# EAGLE design BOOST-IR (EAGLE 6.5.0)
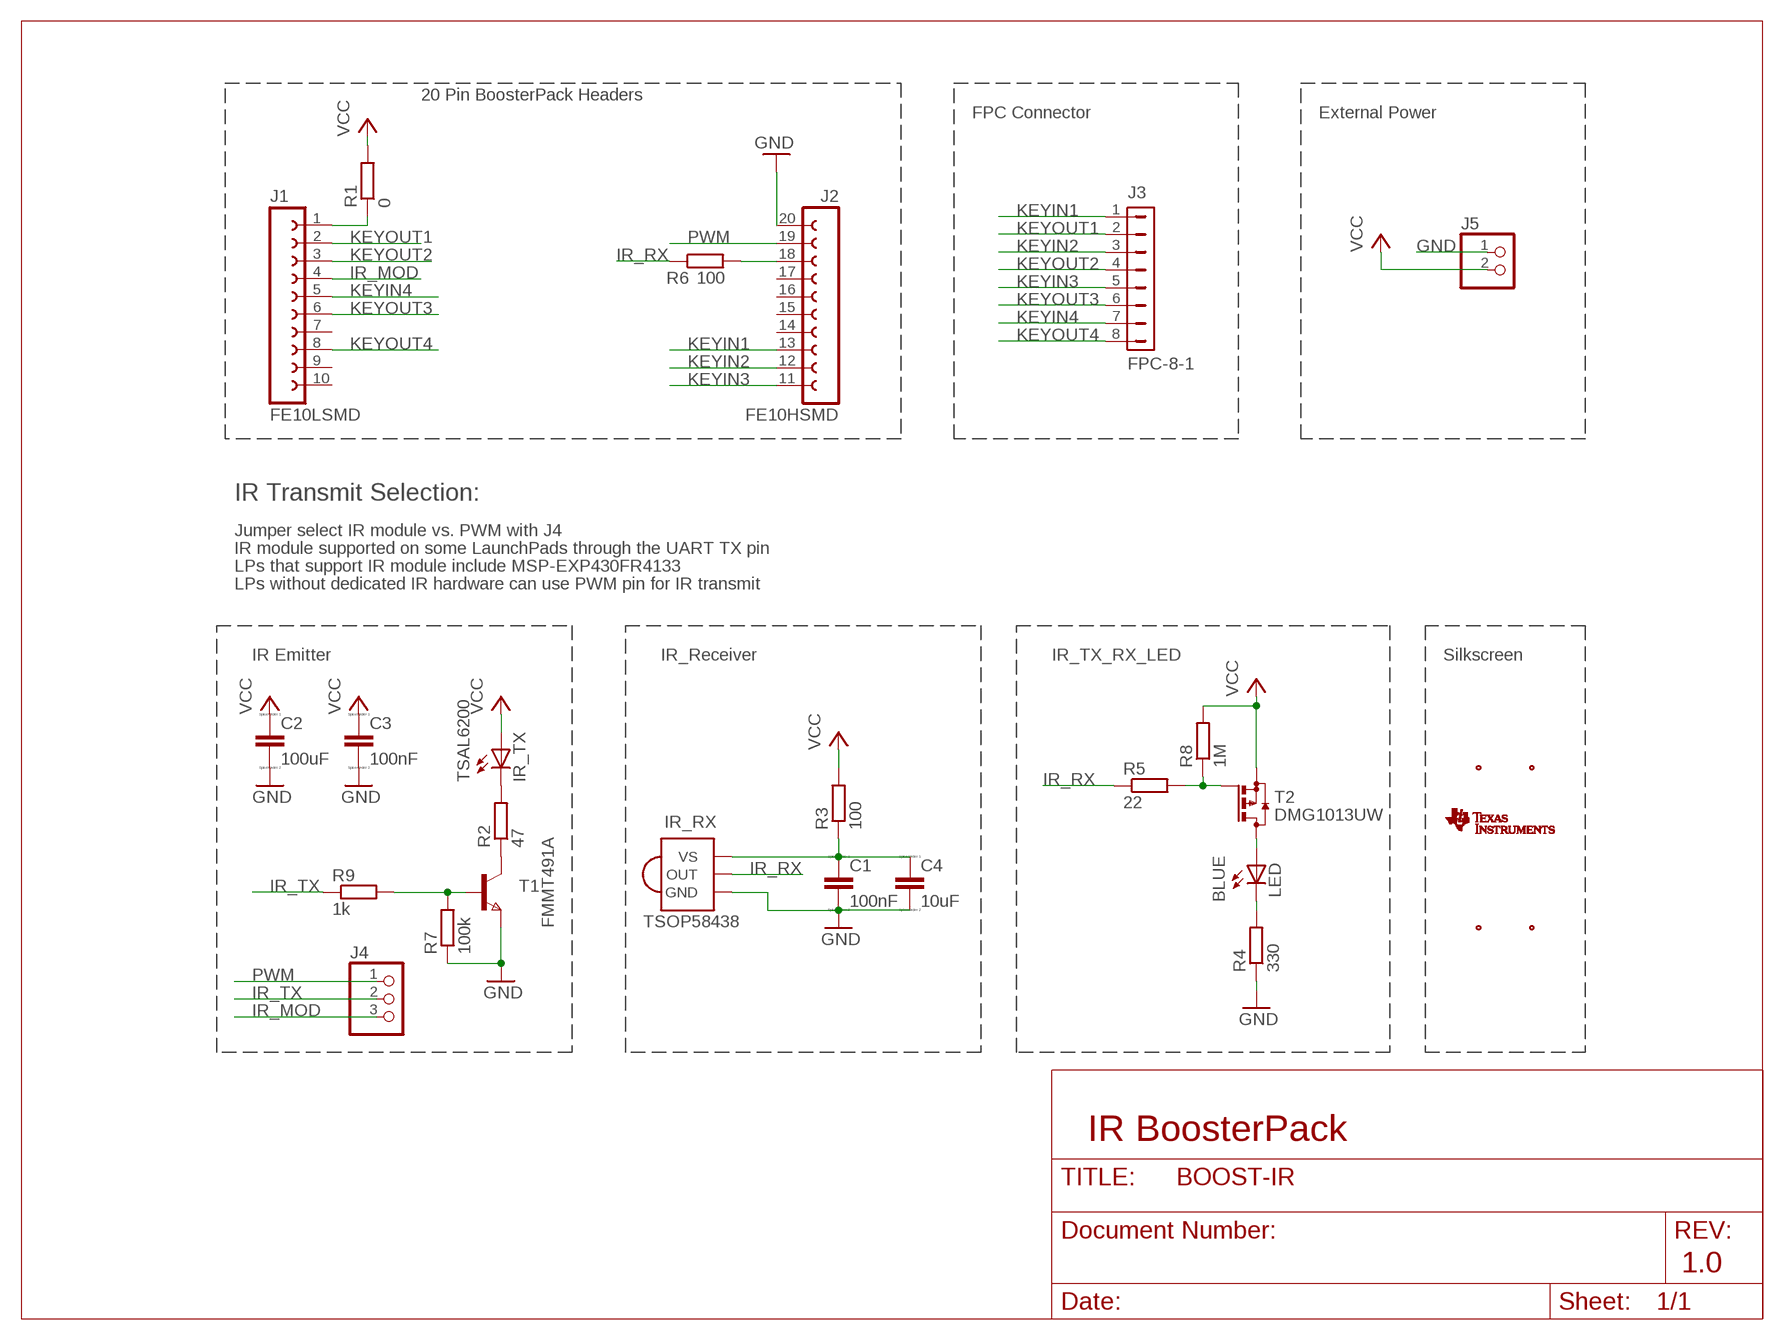
[diagram p0: schematic, sheet 1]

## Parts
C1  100nF  CC0603  [C0603]
C2  100uF  CC1206  [C1206]
C3  100nF  CC0603  [C0603]
C4  10uF  C  [C0805]
IR_RX  TSOP58438  [TSOP58438]
IR_TX  TSAL6200  IR_LED  [IR_LED_PAC]
J1  FE10LSMD  [FE10SMD]
J2  FE10HSMD  [FE10HSMD]
J3  FPC-8-1  FPC_BP  [FPC_IR]
J4  PINHD1X3  [1X03]
J5  HEADER1X2  [HEADER1X2]
LED  BLUE  LEDCHIPLED_0603  [CHIPLED_0603]
R1  0  R-EU_R1206  [R1206]
R2  47  R-EU_R1206  [R1206]
R3  100  R-EU_R0603  [R0603]
R4  330  R-EU_R0603  [R0603]
R5  22  R-EU_R0603  [R0603]
R6  100  R-EU_R0603  [R0603]
R7  100k  R-EU_R0603  [R0603]
R8  1M  R-EU_R0603  [R0603]
R9  1k  R-EU_R0603  [R0603]
T1  FMMT491A  NPNSOT23  [SOT-23]
T2  DMG1013UW  [SOT323]
U$1  BOOST-IR_EXTPOWER  [BOOST-IR_EXTPOWER]
U$3  TI_LOGO_LETTERS  [TI_LOGO_WORDS]
U$4  BOOST-IR_LABEL  [BOOST-IR_LABEL]
U$5  BOOST-IR_REV0.1LOGO  [BOOST-IR_LOGO]
U$6  BOOST-IR_REV0.1LOGOSMALL  [BOOST-IR_LOGOSMALL]

## Nets
GND: C1.2 C2.2 C3.2 C4.2 IR_RX.GND J2.20 J5.1 R4.1 R7.1 T1.2(E)
IR_MOD: J1.4 J4.3
IR_RX: IR_RX.OUT R5.1 R6.1
IR_TX: J4.2 R9.1
KEYIN1: J2.13 J3.1
KEYIN2: J2.12 J3.3
KEYIN3: J2.11 J3.5
KEYIN4: J1.5 J3.7
KEYOUT1: J1.2 J3.2
KEYOUT2: J1.3 J3.4
KEYOUT3: J1.6 J3.6
KEYOUT4: J1.8 J3.8
N$1: R2.1 T1.1(C)
N$2: IR_TX.K(C) R2.2
N$4: R7.2 R9.2 T1.3(B)
N$5: C1.1 C4.1 IR_RX.VS R3.1
N$9: R5.2 R8.1 T2.1(G)
N$10: LED.A T2.3(D)
N$11: LED.C R4.2
N$12: J2.18 R6.2
N$15: J1.1 R1.1
PWM: J2.19 J4.1
VCC: C2.1 C3.1 IR_TX.A J5.2 R1.2 R3.2 R8.2 T2.2(S)
Unconnected: J1.7 J1.9 J1.10 J2.14 J2.15 J2.16 J2.17

## Notes on the sheet
- 20 Pin BoosterPack Headers
- FPC Connector | External Power
- IR Transmit Selection:
- Jumper select IR module vs. PWM with J4
- IR module supported on some LaunchPads through the UART TX pin
- LPs that support IR module include MSP-EXP430FR4133
- LPs without dedicated IR hardware can use PWM pin for IR transmit
- IR Emitter | IR_Receiver | IR_TX_RX_LED | Silkscreen
- IR BoosterPack
- 1.0

## Library data of the parts
C1-C4 = eagle-ltspice:C: CAPACITOR, European symbol; SPICEMODEL: NONE; SPICEPREFIX: C
IR_RX = TSOP58438:TSOP58438: IR Receiver Modules for Remote Control Systems; IR: TSOP58438
IR_TX = IrBoosterPack:IR_LED
J1 = LibraryLaunchPad:FE10LSMD
J2 = LibraryLaunchPad:FE10HSMD
J3 = FPC_IR:FPC_BP
J4 = F5529LP_pinhead:PINHD1X3
J5 = F5529LP_pinhead:HEADER1X2
LED = led:LED: LED OSRAM: - CHIPLED LG R971, LG N971, LY N971, LG Q971, LY Q971, LO R971, LY R971 LH N974, LH R974 LS Q976, LO Q976, LY Q976 LO Q996 - Hyper CHIPLED LW Q18S LB Q993, LB Q99A, LB R99A - SideLED LS A670, LO A670, LY A670, LG A670, LP A670 LB A673, LV A673, LT A673, LW A673 LH A674 LY A675 LS A676, LA A676, LO A676, LY A676, LW A676 LS A679, LY A679, LG A679 - Hyper Micro SIDELED® LS Y876, LA Y876, LO Y876, LY Y876 LT Y87S - SmartLED LW L88C, LW L88S LB L89C, LB L89S, LG L890 LS L89K, LO L89K, LY L89K LS L896, LA L896, LO L896, LY L896 - TOPLED LS T670, LO T670, LY T670, LG T670, LP T670 LSG T670, LSP T670, LSY T670, LOP T670, LYG T670 LG T671, LOG T671, LSG T671 LB T673, LV T673, LT T673, LW T673 LH T674 LS T676, LA T676, LO T676, LY T676, LB T676, LH T676, LSB T676, LW T676 LB T67C, LV T67C, LT T67C, LS T67K, LO T67K, LY T67K, LW E67C LS E67B, LA E67B, LO E67B, LY E67B, LB E67C, LV E67C, LT E67C LW T67C LS T679, LY T679, LG T679 LS T770, LO T770, LY T770, LG T770, LP T770 LB T773, LV T773, LT T773, LW T773 LH T774 LS E675, LA E675, LY E675, LS T675 LS T776, LA T776, LO T776, LY T776, LB T776 LHGB T686 LT T68C, LB T68C - Hyper Mini TOPLED® LB M676 - Mini TOPLED Santana® LG M470 LS M47K, LO M47K, LY M47K Source: http://www.osram.convergy.de LUXEON: - LUMILED® LXK2-PW12-R00, LXK2-PW12-S00, LXK2-PW14-U00, LXK2-PW14-V00 LXK2-PM12-R00, LXK2-PM12-S00, LXK2-PM14-U00 LXK2-PE12-Q00, LXK2-PE12-R00, LXK2-PE12-S00, LXK2-PE14-T00, LXK2-PE14-U00 LXK2-PB12-K00, LXK2-PB12-L00, LXK2-PB12-M00, LXK2-PB14-N00, LXK2-PB14-P00, LXK2-PB14-Q00 LXK2-PR12-L00, LXK2-PR12-M00, LXK2-PR14-Q00, LXK2-PR14-R00 LXK2-PD12-Q00, LXK2-PD12-R00, LXK2-PD12-S00 LXK2-PH12-R00, LXK2-PH12-S00 LXK2-PL12-P00, LXK2-PL12-Q00, LXK2-PL12-R00 Source: www.luxeon.com KINGBRIGHT: KA-3528ASYC Source: www.kingbright.com
R1-R9 = rcl:R-EU_: RESISTOR, European symbol
T1 = zetex:NPNSOT23: NPN TRANSISTOR; MPN: DSS20201L-7; OC_FARNELL: 1710688; OC_NEWARK: 25R4555
T2 = MSP430G6_LP:DMG1013UW
U$1 = LaunchPad:BOOST-IR_EXTPOWER
U$3 = LaunchPad:TI_LOGO_LETTERS
U$4 = LaunchPad:BOOST-IR_LABEL
U$5 = LaunchPad:BOOST-IR_REV0.1LOGO
U$6 = LaunchPad:BOOST-IR_REV0.1LOGOSMALL

## Board
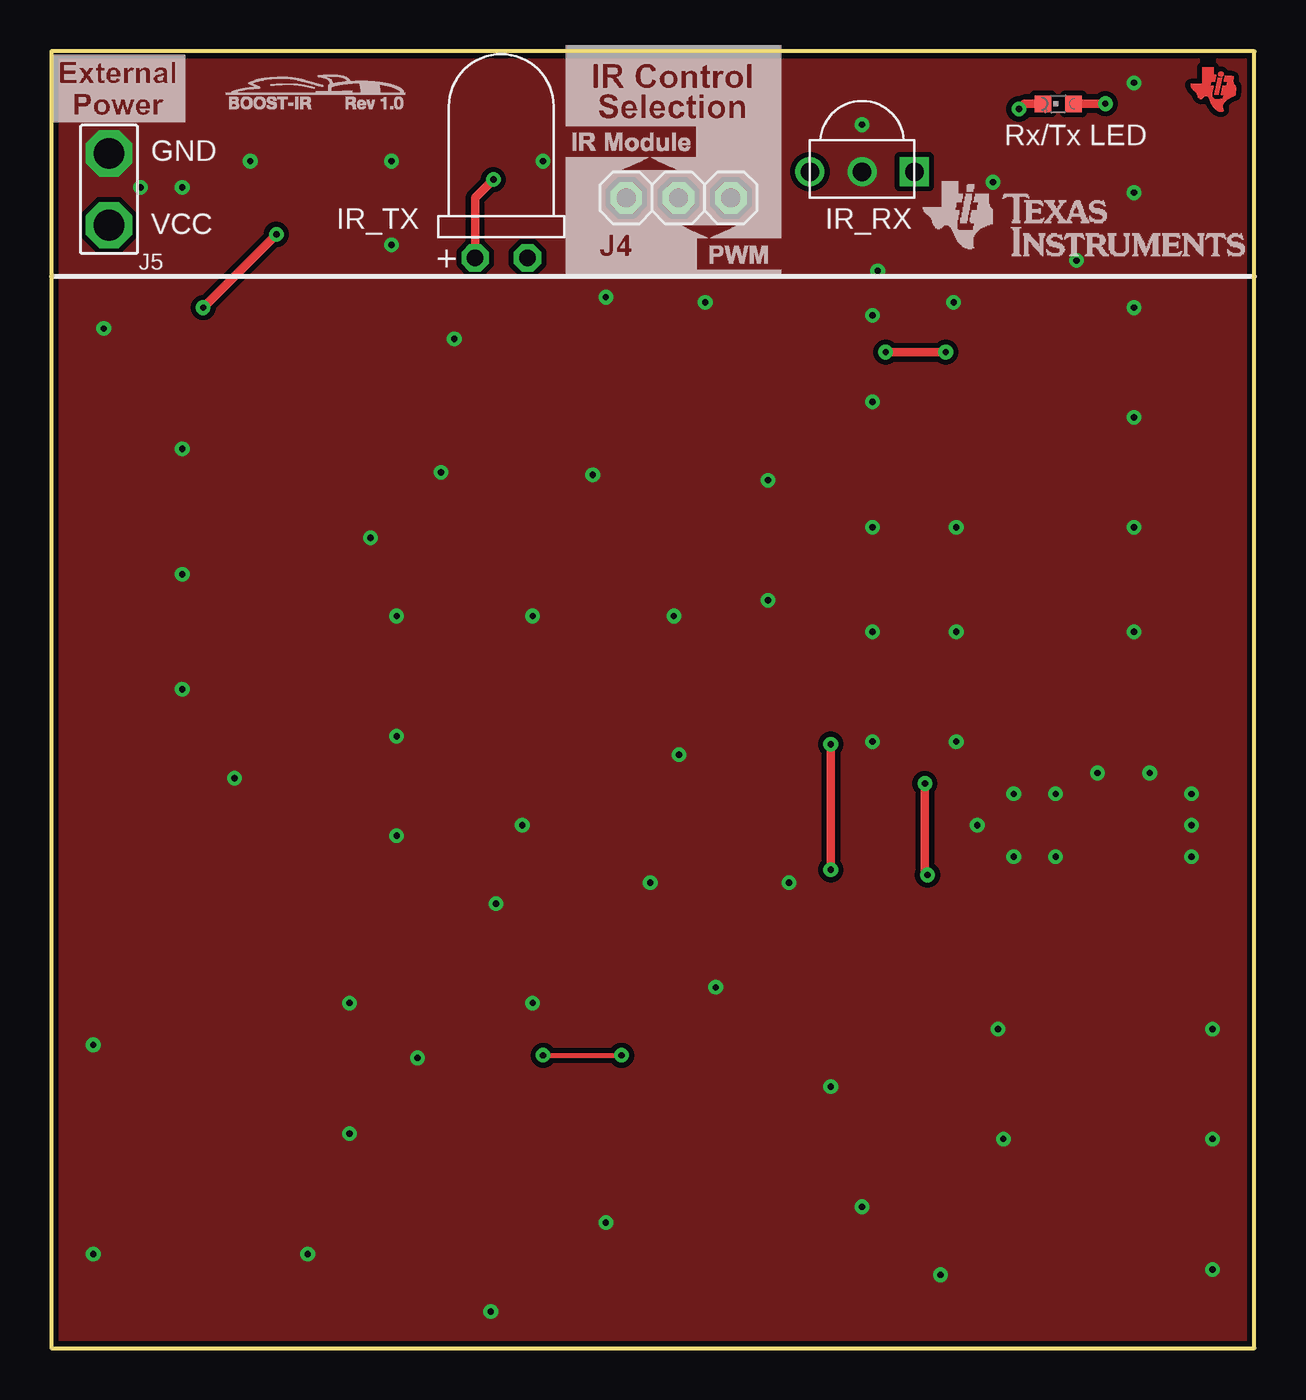
[diagram p1: board, top side]
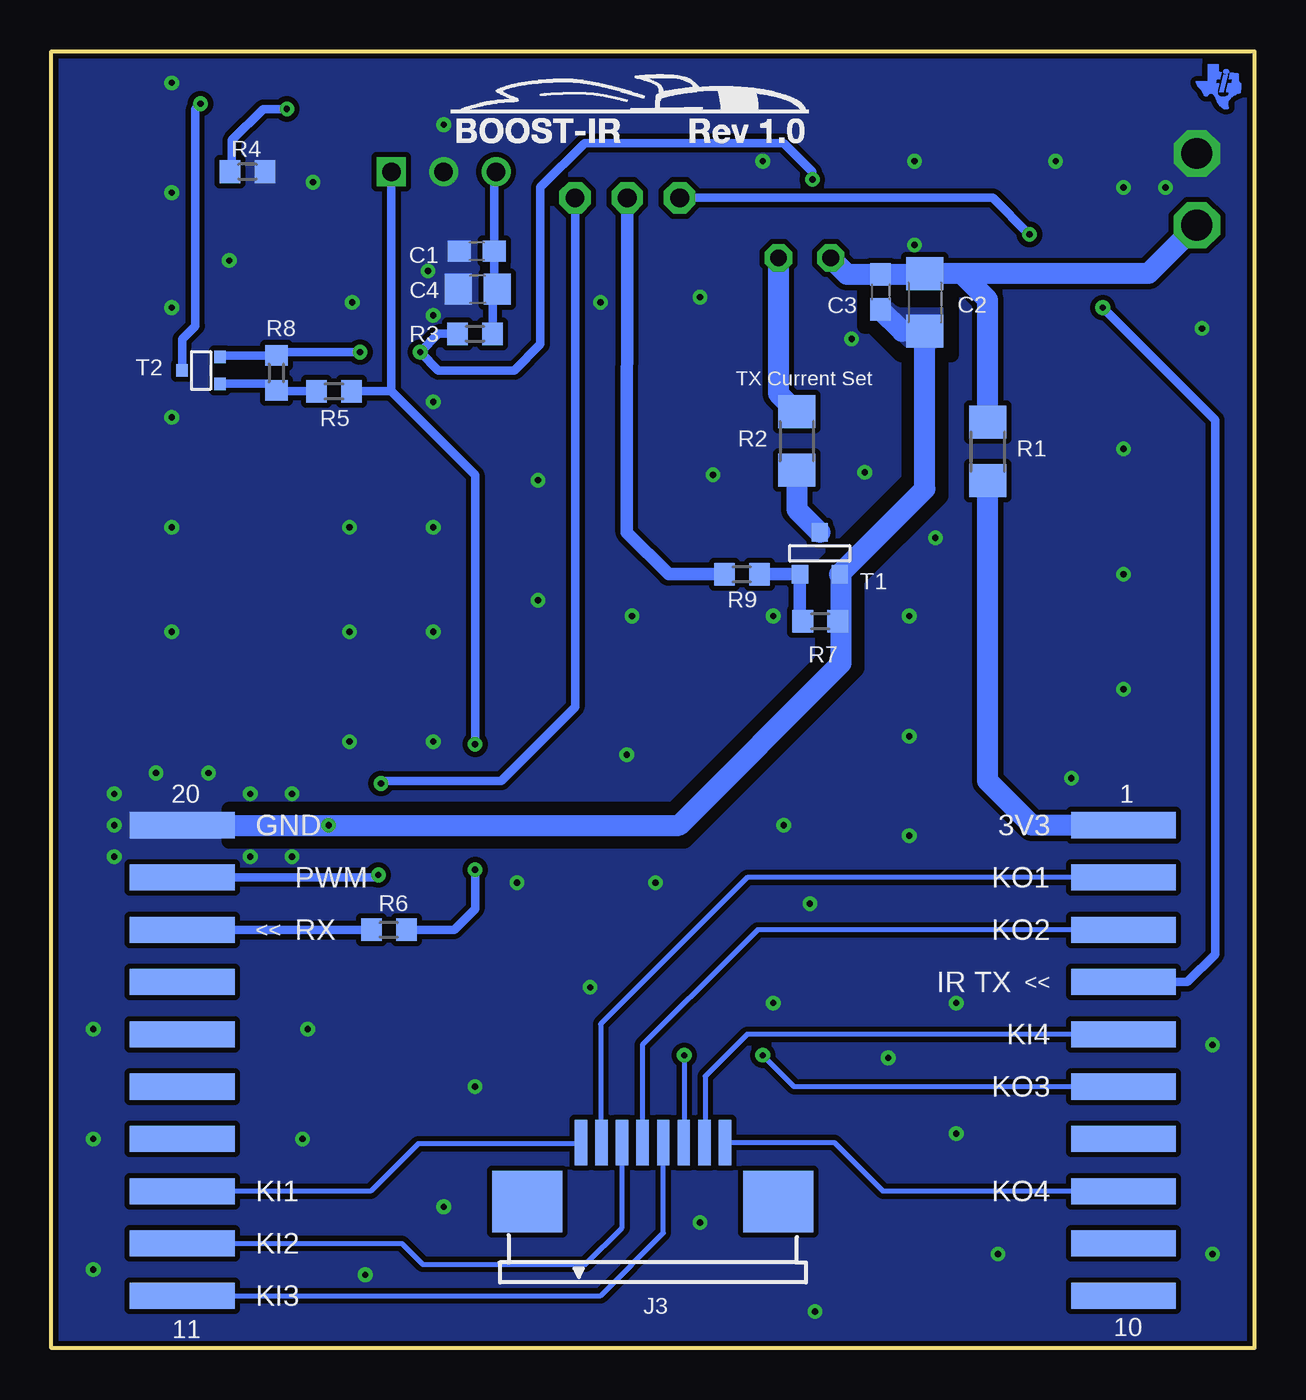
[diagram p2: board, bottom side, seen from below]

Size 58.42 x 62.99 mm. Coordinates in mm from the lower left corner, seen from the top.
Outline: 0,0 58.42,0 58.42,62.99 0,62.99 0,0
Copper layers (1+2*15+16): Top 0.0178mm / dielectric 12mil / Route2 0.0356mm / dielectric 27mil / Route15 0.0356mm / dielectric 12mil / Bottom 0.0178mm
Design rules "MSP430 PCBExpress 4-layer-dietmar": minimum track width 6mil, minimum drill 12mil, track to track 6mil, track to pad 6mil, pad to pad 6mil, via to via 8mil, smd to smd 6mil, copper to edge 8mil, drill to drill 8mil, minimum pad ring 10mil, minimum via ring 8mil, stop-mask expansion 8mil, vias tented up to drill 15mil, thermal gap 8mil
bRestrict: 20 lines

### Footprints (pad centres in the part's own frame; a part is rotated, then mirrored left to right if it is on the bottom)
C0603 = smd 1.1 x 1: 1 -0.85,0; 2 0.85,0
C1206 = smd 1.6 x 1.8: 1 -1.4,0; 2 1.4,0
C0805 = smd 1.3 x 1.5: 1 -0.95,0; 2 0.95,0
TSOP58438 = drill 0.9: GND 0,0; VS 2.54,0 | drill 0.9 square: OUT -2.54,0
IR_LED_PAC = drill 0.813 octagon: A -1.27,0; K 1.27,0
FE10SMD = smd 1.27 x 5.08: 1 0,0; 2 2.54,0; 3 5.08,0; 4 7.62,0; 5 10.16,0; 6 12.7,0; 7 15.24,0; 8 17.78,0; 9 20.32,0; 10 22.86,0
FE10HSMD = smd 1.27 x 5.08: 11 0,0; 12 -2.54,0; 13 -5.08,0; 14 -7.62,0; 15 -10.16,0; 16 -12.7,0; 17 -15.24,0; 18 -17.78,0; 19 -20.32,0; 20 -22.86,0
FPC_IR = smd 0.6 x 2.2: 1 -3.5,4.4; 2 -2.5,4.4; 3 -1.5,4.4; 4 -0.5,4.4; 5 0.5,4.4; 6 1.5,4.4; 7 2.5,4.4; 8 3.5,4.4 | smd 3.4 x 3: P$1 6.096,1.524; P$2 -6.096,1.524
1X03 = drill 0.914 pad 1.524 octagon: 1 -2.54,0; 2 0,0; 3 2.54,0
HEADER1X2 = drill 1.5 pad 2.2 octagon: 1 0,0; 2 3.49,0
CHIPLED_0603 = smd 0.8 x 0.8: A 0,-0.75; C 0,0.75
R1206 = smd 1.6 x 1.803: 1 -1.422,0; 2 1.422,0
R0603 = smd 1 x 1.1: 1 -0.85,0; 2 0.85,0
SOT-23 = smd 0.787 x 0.889: 1 0.025,-1.016; 2 -0.94,1.016; 3 0.991,1.016
SOT323 = smd 0.6 x 0.55: 1 -0.65,-0.825; 2 0.65,-0.825; 3 0,1.025

### Placement (x,y rotation side)
C1  37.77,53.29 180 bottom
C2  16,50.8 270 bottom
C3  18.16,51.31 270 bottom
C4  37.72,51.44 180 bottom
IR_RX  39.37,57.15 180 top
IR_TX  21.84,52.96 0 top
J1  6.35,25.4 270 bottom
J2  52.07,2.54 270 bottom
J3  29.21,5.59 0 bottom
J4  30.45,55.88 180 top
J5  2.79,58.04 270 top
LED  48.9,60.45 90 top
R1  12.95,43.56 90 bottom
R2  22.23,44.07 90 bottom
R3  37.85,49.28 180 bottom
R4  48.9,57.15 180 bottom
R5  44.7,46.48 180 bottom
R6  42.04,20.32 180 bottom
R7  21.08,35.31 180 bottom
R8  47.5,47.37 90 bottom
R9  24.89,37.59 0 bottom
T1  21.08,38.61 180 bottom
T2  51.05,47.5 90 bottom
U$1  0,59.56 0 top
U$2  [TILOGO_SMALL]  56.57,61.42 0 top
U$3  41.99,52.3 0 top
U$4  24.79,52.02 0 top
U$5  21.08,58.55 0 top
U$6  8.38,60.2 0 top
U$7  [TILOGO_SMALL]  1.6,61.54 0 bottom

### Tracks (layer width: path | path; a pad name or v marks a point on that pad's centre or on a via)
GND  (via drill 0.3)
  Bottom 1.016: J2.20 27.94,25.4 20.07,33.27 20.07,37.52 T1.2 16,41.73 C2.2 17.1,49.4 C3.2
  other vias: 6.35,37.59 8.89,27.69 40.13,52.32 39.88,50.16 39.88,45.97 39.88,39.88 39.88,34.8 43.94,39.88 43.94,34.8 43.94,29.46 39.88,29.46 44.96,25.4 46.74,26.92 46.74,23.88 55.37,23.88 55.37,25.4 55.37,26.92 53.34,27.94 50.8,27.94 48.77,26.92 52.58,34.8 52.58,39.88 52.58,45.21 52.58,50.55 52.58,56.13 4.32,56.39 6.35,56.39 9.65,57.66 16.51,57.66 23.88,57.66 39.37,59.44 45.72,56.64 49.78,52.83 43.81,50.8 2.54,49.53 6.35,32 6.35,43.69 2.03,14.73 2.03,4.57 12.45,4.57 26.92,6.1 21.34,1.78 43.18,3.56 39.37,6.86 46.23,10.16 45.97,15.49 37.85,12.7 29.08,22.61 35.81,22.61 32.26,17.53 16.76,24.89 16.76,29.72 16.76,35.56 15.49,39.37 23.37,35.56 30.23,35.56 30.48,28.83 31.75,50.8 26.92,51.05 19.56,49.02 16.51,53.59 52.58,61.47 34.8,42.16 34.8,36.32 26.29,42.42 14.48,16.76 23.37,16.76 21.59,21.59 14.48,10.41 48.77,23.88 56.39,15.49 56.39,10.16 56.39,3.81 22.86,25.4 17.78,14.1 18.92,42.55
  pour Bottom (isolate 0.254, no thermals): 0,62.99 0,0 58.42,0 58.42,62.99
  pour Top (isolate 0.254, no thermals): 0,62.99 0,0 58.42,0 58.42,62.99
IR_MOD  (via drill 0.3)
  Top 0.406: v10.92,54.1 v7.37,50.55
  Bottom 0.406: J1.4 3.25,17.78 1.91,19.13 1.91,45.09 v7.37,50.55 | J4.3 12.7,55.88 v10.92,54.1
IR_RX  (via drill 0.3)
  Top 0.406: v37.85,29.34 v37.85,23.24
  Bottom 0.406: v37.85,29.34 37.85,42.42 41.91,46.48 | R5.1 41.91,46.48 | v37.85,23.24 37.85,21.34 38.86,20.32 R6.1 | IR_RX.OUT 41.91,46.48
IR_TX
  Bottom 0.61: R9.1 28.45,37.59 30.48,39.62 J4.2
KEYIN1
  Bottom 0.254: J2.13 42.93,7.62 40.61,9.93 32.77,9.93 J3.1
KEYIN2
  Bottom 0.254: J2.12 41.4,5.08 40.39,4.06 32.49,4.06 30.71,5.84 | 30.73,5.84 30.71,5.84 | 30.71,5.84 J3.3
KEYIN3
  Bottom 0.254: J2.11 31.75,2.54 28.7,5.59 28.71,5.59 J3.5
KEYIN4
  Bottom 0.254: J1.5 24.64,15.24 26.67,13.21 26.67,11.04 J3.7
KEYOUT1
  Bottom 0.254: J1.2 24.64,22.86 31.75,15.75 31.75,11.04 J3.2
KEYOUT2
  Bottom 0.254: J3.4 29.72,11.01 29.72,14.73 25.15,19.3 24.13,20.32 J1.3
KEYOUT3  (via drill 0.3)
  Top 0.254: v23.88,14.22 v27.69,14.22
  Bottom 0.254: J1.6 22.35,12.7 v23.88,14.22 | v27.69,14.22 27.69,11.03 J3.6
KEYOUT4
  Bottom 0.254: J1.8 18.03,7.62 20.4,9.99 J3.8
N$1
  Bottom 1.016: R2.1 22.23,40.74 T1.1
N$2
  Bottom 1.016: IR_TX.K 23.11,46.38 R2.2
N$4
  Bottom 0.61: R9.2 T1.3 22.07,35.45 R7.2
N$5
  Bottom 0.406: 36.83,53.38 C1.1 | C1.1 36.92,51.59 C4.1 37,51.21 R3.1 | IR_RX.VS 36.92,57.15 C1.1
N$9
  Bottom 0.406: R5.2 47.2,46.48 R8.1 | 47.28,46.48 R8.1 | R8.1 47.83,46.85 T2.1
N$10  (via drill 0.3)
  Top 0.406: v51.18,60.45 LED.A
  Bottom 0.406: T2.3 52.08,49.01 51.44,49.66 51.44,60.2 v51.18,60.45
N$11  (via drill 0.3)
  Top 0.406: LED.C 47.24,60.45 v46.99,60.2
  Bottom 0.406: v46.99,60.2 48.13,60.2 49.66,58.67 49.66,57.24 R4.2
N$12
  Bottom 0.406: J2.18 R6.2
N$15
  Bottom 1.016: J1.1 10.79,25.4 12.95,27.56 R1.1
PWM  (via drill 0.3)
  Top 0.406: v42.42,27.43 42.42,23.11 v42.55,22.99
  Bottom 0.406: J4.1 32.99,31.14 36.58,27.56 42.29,27.56 v42.42,27.43 | v42.55,22.99 42.67,22.86 J2.19
VCC  (via drill 0.3)
  Top 0.406: v40.51,48.39 v43.43,48.39 | IR_TX.A 20.57,55.88 v21.46,56.77
  Bottom 0.406: v21.46,56.77 21.46,57.15 22.86,58.55 32.51,58.55 34.67,56.39 34.67,48.77 35.94,47.5 39.62,47.5 v40.51,48.39 39.62,49.28 R3.2 | v43.43,48.39 47.08,48.39 R8.2 | 47.46,48.44 R8.2 | R8.2 50.23,48.22 T2.2
  Bottom 1.016: J5.2 5.14,52.2 14.22,52.2 | 14.22,52.2 C2.1 16.04,52.16 C3.1 19.77,52.16 IR_TX.A | R1.2 12.95,50.93 14.22,52.2

### Text on the board
tPlace: Rx/Tx LED | GND | VCC | +
bPlace: TX Current Set | 1 | 20 | 3V3 | GND | KO1 | PWM | KO2 | RX | << | << | IR TX | KI4 | KO3 | KO4 | KI1 | KI2 | KI3 | 10 | 11